# EAGLE schematic Schematic-1 (EAGLE 8.2.1)
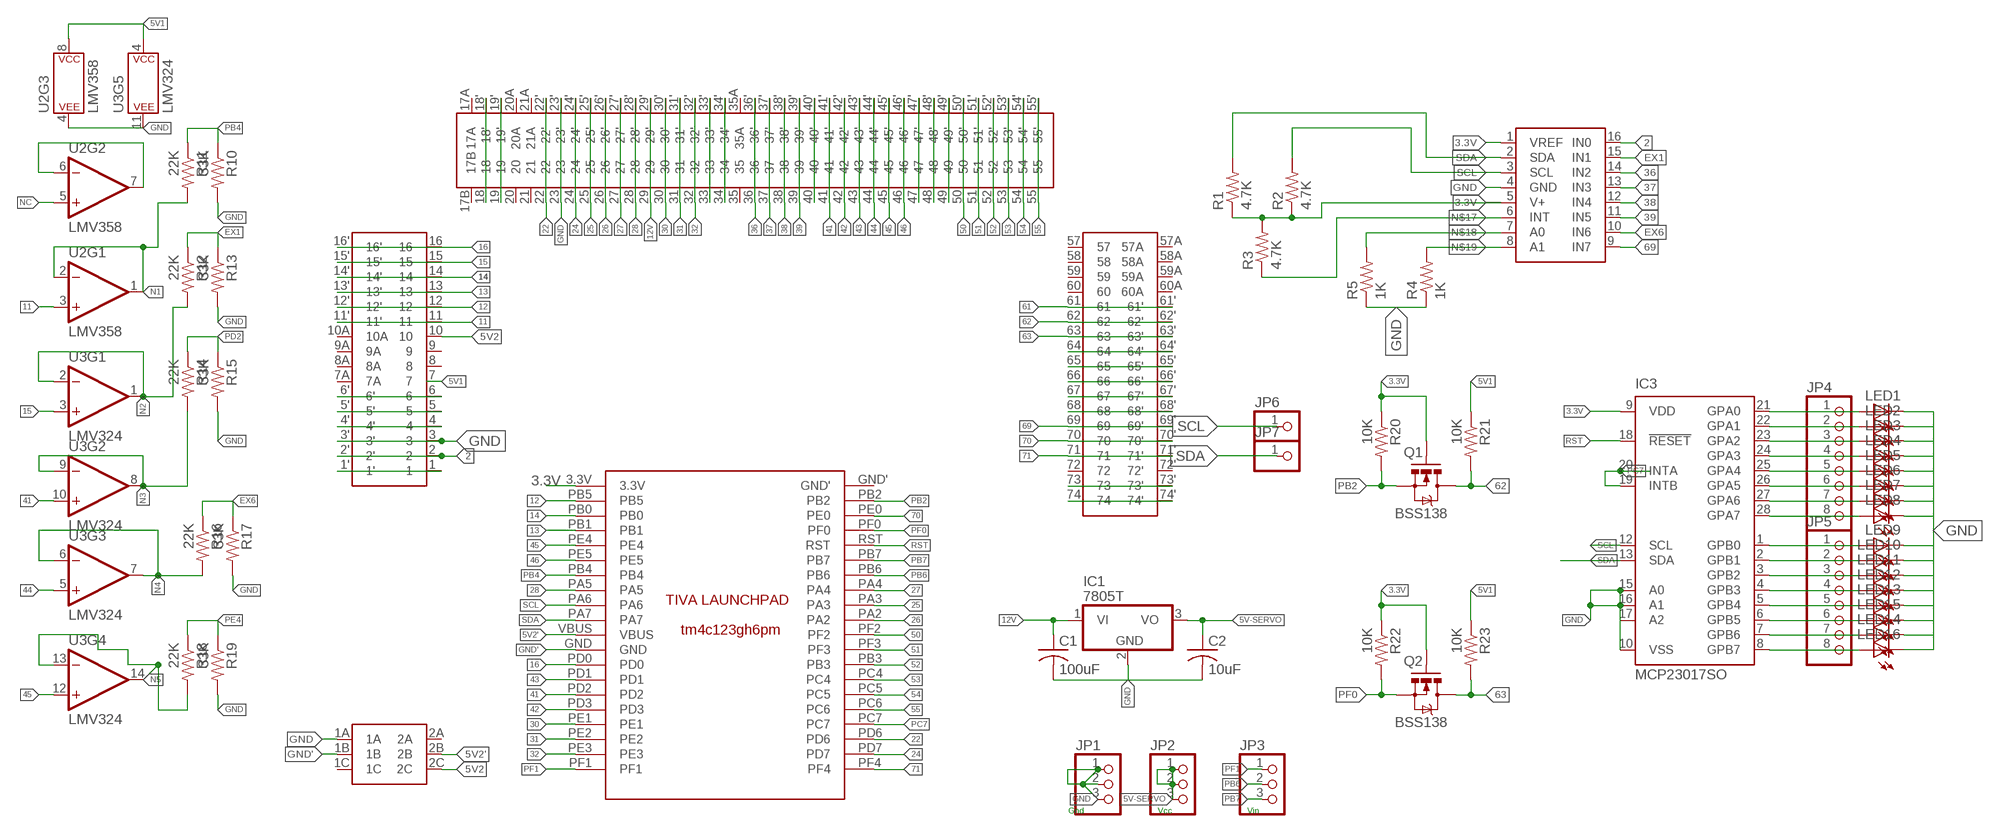
[diagram p0: schematic, sheet 1]

## Parts
C1  100uF  C-US025-030X050  [C025-030X050]
C2  10uF  C-US025-030X050  [C025-030X050]
IC1  7805T  [TO220H]
IC3  MCP23017SO  [SO28W]
JP1  PINHD-1X3  [1X03]
JP2  PINHD-1X3  [1X03]
JP3  PINHD-1X3  [1X03]
JP4  PINHD-1X8BIG  [1X08-BIG]
JP5  PINHD-1X8BIG  [1X08-BIG]
JP6  PINHD-1X1  [1X01]
JP7  PINHD-1X1  [1X01]
LED1  LEDSMT1206  [1206]
LED2  LEDSMT1206  [1206]
LED3  LEDSMT1206  [1206]
LED4  LEDSMT1206  [1206]
LED5  LEDSMT1206  [1206]
LED6  LEDSMT1206  [1206]
LED7  LEDSMT1206  [1206]
LED8  LEDSMT1206  [1206]
LED9  LEDSMT1206  [1206]
LED10  LEDSMT1206  [1206]
LED11  LEDSMT1206  [1206]
LED12  LEDSMT1206  [1206]
LED13  LEDSMT1206  [1206]
LED14  LEDSMT1206  [1206]
LED15  LEDSMT1206  [1206]
LED16  LEDSMT1206  [1206]
Q1  BSS138  MOSFET-NCHANNELSMD  [SOT23-3]
Q2  BSS138  MOSFET-NCHANNELSMD  [SOT23-3]
R1  4.7K  R-US_M1206  [M1206]
R2  4.7K  R-US_M1206  [M1206]
R3  4.7K  R-US_M1206  [M1206]
R4  1K  R-US_M1206  [M1206]
R5  1K  R-US_M1206  [M1206]
R10  33K  R-US_M1206  [M1206]
R11  22K  R-US_M1206  [M1206]
R12  22K  R-US_M1206  [M1206]
R13  33K  R-US_M1206  [M1206]
R14  22K  R-US_M1206  [M1206]
R15  33K  R-US_M1206  [M1206]
R16  22K  R-US_M1206  [M1206]
R17  33K  R-US_M1206  [M1206]
R18  22K  R-US_M1206  [M1206]
R19  33K  R-US_M1206  [M1206]
R20  10K  RESISTOR1206  [1206]
R21  10K  RESISTOR1206  [1206]
R22  10K  RESISTOR1206  [1206]
R23  10K  RESISTOR1206  [1206]
U2  LMV358  LMV358SOIC  [SO08]
U3  LMV324  [SO14]
U$1  DAUGHTERBOARDDAUGHTERBOARD  [DAUGHTERBOARD]
U$2  TIVA_LAUNCHPADTIVA_LAUNCHPAD  [TIVA_LAUNCHPAD]
U$3  SELF-LOCKING_SWITCHSELF-LOCKING_SWITCH  [SELF-LOCKING_SWITCH]
U$4  ADC128D818  [ADC12_SD]

## Nets
2: U$1.2 U$1.2' U$4.16(IN0)
3.3V [3.3V]: IC3.9(VDD) Q1.1(G) Q2.1(G) R1.1 R2.1 R3.2 R20.1 R22.1 U$2.3.3V U$4.1(VREF) U$4.5(V+)
5V1 [5V1]: R21.1 R23.1 U2.8(P$V+) U3.4(P$V+) U$1.7
5V2 [5V1]: U$1.10 U$3.2C
5V2' [5V1]: U$2.VBUS U$3.2B
5V-SERVO [5V-SERVO]: C2.1 IC1.3(VO) JP2.1 JP2.2 JP2.3
11: U2.3(+IN) U$1.11 U$1.11'
12: U$1.12 U$1.12' U$2.PB5
12V [12V]: C1.1 IC1.1(VI) U$1.29 U$1.29'
13: U$1.13 U$1.13' U$2.PB1
14: U$1.14 U$1.14' U$2.PB0
15: U3.3(+IN) U$1.15 U$1.15'
16: U$1.16 U$1.16' U$2.PD0
22: U$1.22 U$1.22' U$2.PD6
24: U$1.24 U$1.24' U$2.PD7
25: U$1.25 U$1.25' U$2.PA3
26: U$1.26 U$1.26' U$2.PA2
27: U$1.27 U$1.27' U$2.PA4
28: U$1.28 U$1.28' U$2.PA5
30: U$1.30 U$1.30' U$2.PE1
31: U$1.31 U$1.31' U$2.PE2
32: U$1.32 U$1.32' U$2.PE3
36: U$1.36 U$1.36' U$4.14(IN2)
37: U$1.37 U$1.37' U$4.13(IN3)
38: U$1.38 U$1.38' U$4.12(IN4)
39: U$1.39 U$1.39' U$4.11(IN5)
41: U3.10(+IN) U$1.41 U$1.41' U$2.PD2
42: U$1.42 U$1.42' U$2.PD3
43: U$1.43 U$1.43' U$2.PD1
44: U3.5(+IN) U$1.44 U$1.44'
45: U3.12(+IN) U$1.45 U$1.45' U$2.PE4
46: U$1.46 U$1.46' U$2.PE5
50: U$1.50 U$1.50' U$2.PF2
51: U$1.51 U$1.51' U$2.PF3
52: U$1.52 U$1.52' U$2.PB3
53: U$1.53 U$1.53' U$2.PC4
54: U$1.54 U$1.54' U$2.PC5
55: U$1.55 U$1.55' U$2.PC6
61: U$1.61 U$1.61'
62: Q1.3(D) R21.2 U$1.62 U$1.62'
63: Q2.3(D) R23.2 U$1.63 U$1.63'
69: U$1.69 U$1.69' U$4.9(IN7)
70: U$1.70 U$1.70' U$2.PE0
71: U$1.71 U$1.71' U$2.PF4
EX1: R12.1 R13.1 U$4.15(IN1)
EX6: R16.1 R17.1 U$4.10(IN6)
GND [5V1]: C1.2 C2.2 IC1.2(GND) IC3.10(VSS) IC3.15(A0) IC3.16(A1) IC3.17(A2) JP1.1 JP1.2 JP1.3 LED1.C LED2.C LED3.C LED4.C LED5.C LED6.C LED7.C LED8.C LED9.C LED10.C LED11.C LED12.C LED13.C LED14.C LED15.C LED16.C R4.1 R5.1 R10.2 R13.2 R15.2 R17.2 R19.2 U2.4(P$V-) U3.11(P$V-) U$1.3 U$1.3' U$1.23 U$1.23' U$3.1A U$4.4(GND)
GND' [5V1]: U$2.GND U$3.1B
N1: R11.2 U2.1(OUT) U2.2(-IN)
N2: R12.2 U3.1(OUT) U3.2(-IN)
N3: R14.2 U3.8(OUT) U3.9(-IN)
N4: R16.2 U3.6(-IN) U3.7(OUT)
N5: R18.2 U3.13(-IN) U3.14(OUT)
N$1: U$1.1 U$1.1'
N$2: U2.6(-IN) U2.7(OUT)
N$3: IC3.21(GPA0) JP4.1 LED1.A
N$4: U$1.4 U$1.4'
N$5: U$1.5 U$1.5'
N$6: U$1.6 U$1.6'
N$7: IC3.23(GPA2) JP4.3 LED3.A
N$8: IC3.24(GPA3) JP4.4 LED4.A
N$9: IC3.22(GPA1) JP4.2 LED2.A
N$10: IC3.25(GPA4) JP4.5 LED5.A
N$11: IC3.26(GPA5) JP4.6 LED6.A
N$12: IC3.27(GPA6) JP4.7 LED7.A
N$13: U$1.18 U$1.18'
N$14: U$1.19 U$1.19'
N$15: IC3.28(GPA7) JP4.8 LED8.A
N$17: R3.1 U$4.6(INT)
N$18: R5.2 U$4.7(A0)
N$19: R4.2 U$4.8(A1)
N$20: IC3.1(GPB0) JP5.1 LED9.A
N$21: IC3.2(GPB1) JP5.2 LED10.A
N$22: IC3.3(GPB2) JP5.3 LED11.A
N$23: IC3.4(GPB3) JP5.4 LED12.A
N$24: IC3.5(GPB4) JP5.5 LED13.A
N$25: IC3.6(GPB5) JP5.6 LED15.A
N$26: U$1.33 U$1.33'
N$27: U$1.34 U$1.34'
N$28: IC3.7(GPB6) JP5.7 LED14.A
N$29: IC3.8(GPB7) JP5.8 LED16.A
N$33: U$1.40 U$1.40'
N$39: U$1.47 U$1.47'
N$40: U$1.48 U$1.48'
N$41: U$1.49 U$1.49'
N$51: U$1.64 U$1.64'
N$52: U$1.65 U$1.65'
N$53: U$1.66 U$1.66'
N$54: U$1.67 U$1.67'
N$55: U$1.68 U$1.68'
N$59: U$1.73 U$1.73'
N$60: U$1.74 U$1.74'
NC: U2.5(+IN)
PB2: Q1.2(S) R20.2 U$2.PB2
PB4: R10.1 R11.1 U$2.PB4
PB6: JP3.2 U$2.PB6
PB7: JP3.3 U$2.PB7
PC7: IC3.19(INTB) IC3.20(INTA) U$2.PC7
PD2: R14.1 R15.1
PE4: R18.1 R19.1
PF0: Q2.2(S) R22.2 U$2.PF0
PF1: JP3.1 U$2.PF1
RST: IC3.18(!RESET) U$2.RST
SCL: IC3.12(SCL) JP6.1 R2.2 U$2.PA6 U$4.3(SCL)
SDA: IC3.13(SDA) JP7.1 R1.2 U$2.PA7 U$4.2(SDA)
Unconnected: U$1.7A U$1.8 U$1.8A U$1.9 U$1.9A U$1.10A U$1.17A U$1.17B U$1.20 U$1.20A U$1.21 U$1.21A U$1.35 U$1.35A U$1.57 U$1.57A U$1.58 U$1.58A U$1.59 U$1.59A U$1.60 U$1.60A U$1.72 U$1.72' U$2.GND' U$3.1C U$3.2A

## Notes on the sheet
- Gnd | Vcc | Vin

## Library data of the parts
C1 C2 = adafruit:C-US: CAPACITOR, American symbol
IC1 = adafruit:78*: Positive VOLTAGE REGULATOR Added bigger pads to the TO-92 package
IC3 = adafruit:MCP23017: http://ww1.microchip.com/downloads/en/DeviceDoc/21952a.pdf Source: http://ww1.microchip.com/downloads/en/DeviceDoc/21952a.pdf
JP1-JP3 = adafruit:PINHD-1X3: PIN HEADER
JP4 JP5 = adafruit:PINHD-1X8: PIN HEADER
JP6 JP7 = adafruit:PINHD-1X1: Pin header 1x1 for 0.1" spacing With round pins
LED1-LED16 = adafruit:LED: LED OSRAM: - CHIPLED LG R971, LG N971, LY N971, LG Q971, LY Q971, LO R971, LY R971 LH N974, LH R974 LS Q976, LO Q976, LY Q976 LO Q996 - Hyper CHIPLED LW Q18S LB Q993, LB Q99A, LB R99A - SideLED LS A670, LO A670, LY A670, LG A670, LP A670 LB A673, LV A673, LT A673, LW A673 LH A674 LY A675 LS A676, LA A676, LO A676, LY A676, LW A676 LS A679, LY A679, LG A679 - Hyper Micro SIDELED® LS Y876, LA Y876, LO Y876, LY Y876 LT Y87S - SmartLED LW L88C, LW L88S LB L89C, LB L89S, LG L890 LS L89K, LO L89K, LY L89K LS L896, LA L896, LO L896, LY L896 - TOPLED LS T670, LO T670, LY T670, LG T670, LP T670 LSG T670, LSP T670, LSY T670, LOP T670, LYG T670 LG T671, LOG T671, LSG T671 LB T673, LV T673, LT T673, LW T673 LH T674 LS T676, LA T676, LO T676, LY T676, LB T676, LH T676, LSB T676, LW T676 LB T67C, LV T67C, LT T67C, LS T67K, LO T67K, LY T67K, LW E67C LS E67B, LA E67B, LO E67B, LY E67B, LB E67C, LV E67C, LT E67C LW T67C LS T679, LY T679, LG T679 LS T770, LO T770, LY T770, LG T770, LP T770 LB T773, LV T773, LT T773, LW T773 LH T774 LS E675, LA E675, LY E675, LS T675 LS T776, LA T776, LO T776, LY T776, LB T776 LHGB T686 LT T68C, LB T68C - Hyper Mini TOPLED® LB M676 - Mini TOPLED Santana® LG M470 LS M47K, LO M47K, LY M47K Source: http://www.osram.convergy.de/
Q1 Q2 = SparkFun:MOSFET-NCHANNEL
R1-R5 = rcl:R-US_: RESISTOR, American symbol
R10-R19 = adafruit:R-US_: RESISTOR, American symbol
R20-R23 = SparkFun:RESISTOR: Resistor Basic schematic elements and footprints for 0603, 1206, and PTH resistors.
U2 = SparkFun-IC-Amplifiers:LMV358: IC LMV358 DUAL OP AMP Jellybean rail-to-rail output op-amp SparkFun Products SparkFun PicoBoard <https://www.sparkfun.com/products/11888> (WIG-11888) SparkFun Vernier Interface Shield <https://www.sparkfun.com/products/12858> (DEV-12858) SparkFun Blynk Board - ESP8266 <https://www.sparkfun.com/products/13794> (WRL-13794) SparkFun Digital Sandbox <https://www.sparkfun.com/products/12651> (DEV-12651 RoHS); PROD_ID: IC-09657
U3 = SparkFun-IC-Amplifiers:LMV324: IC LMV324 Quad Op Amp Jellybean quad op-amp Datasheet <http://cdn.sparkfun.com/datasheets/Sensors/Sound/LMV324.pdf> SparkFun Products SparkFun Sensor Kit <https://www.sparkfun.com/products/13754> (DEV-13754) SparkFun Inventor's Kit for Arduino 101 <https://www.sparkfun.com/products/13844> (KIT-13844) SparkFun Sound Detector <https://www.sparkfun.com/products/12642> (SEN-12642); PROD_ID: IC-08227
U$1 = Daughterboard:DAUGHTERBOARD
U$2 = SMD_TIVA_LAUNCHPAD:TIVA_LAUNCHPAD
U$3 = Switch_Self-locking:SELF-LOCKING_SWITCH
U$4 = ADC128D818:ADC128D818

## Net classes
0 default: width 0.2 mm, clearance 0.2 mm
1 5V1: width 1 mm, clearance 0.2 mm
2 3.3V: width 1 mm, clearance 0.2 mm
3 5V-SERVO: width 1 mm, clearance 0.2 mm
4 12V: width 1 mm, clearance 0.2 mm